# Altium project BrushlessDrive.PrjPcb
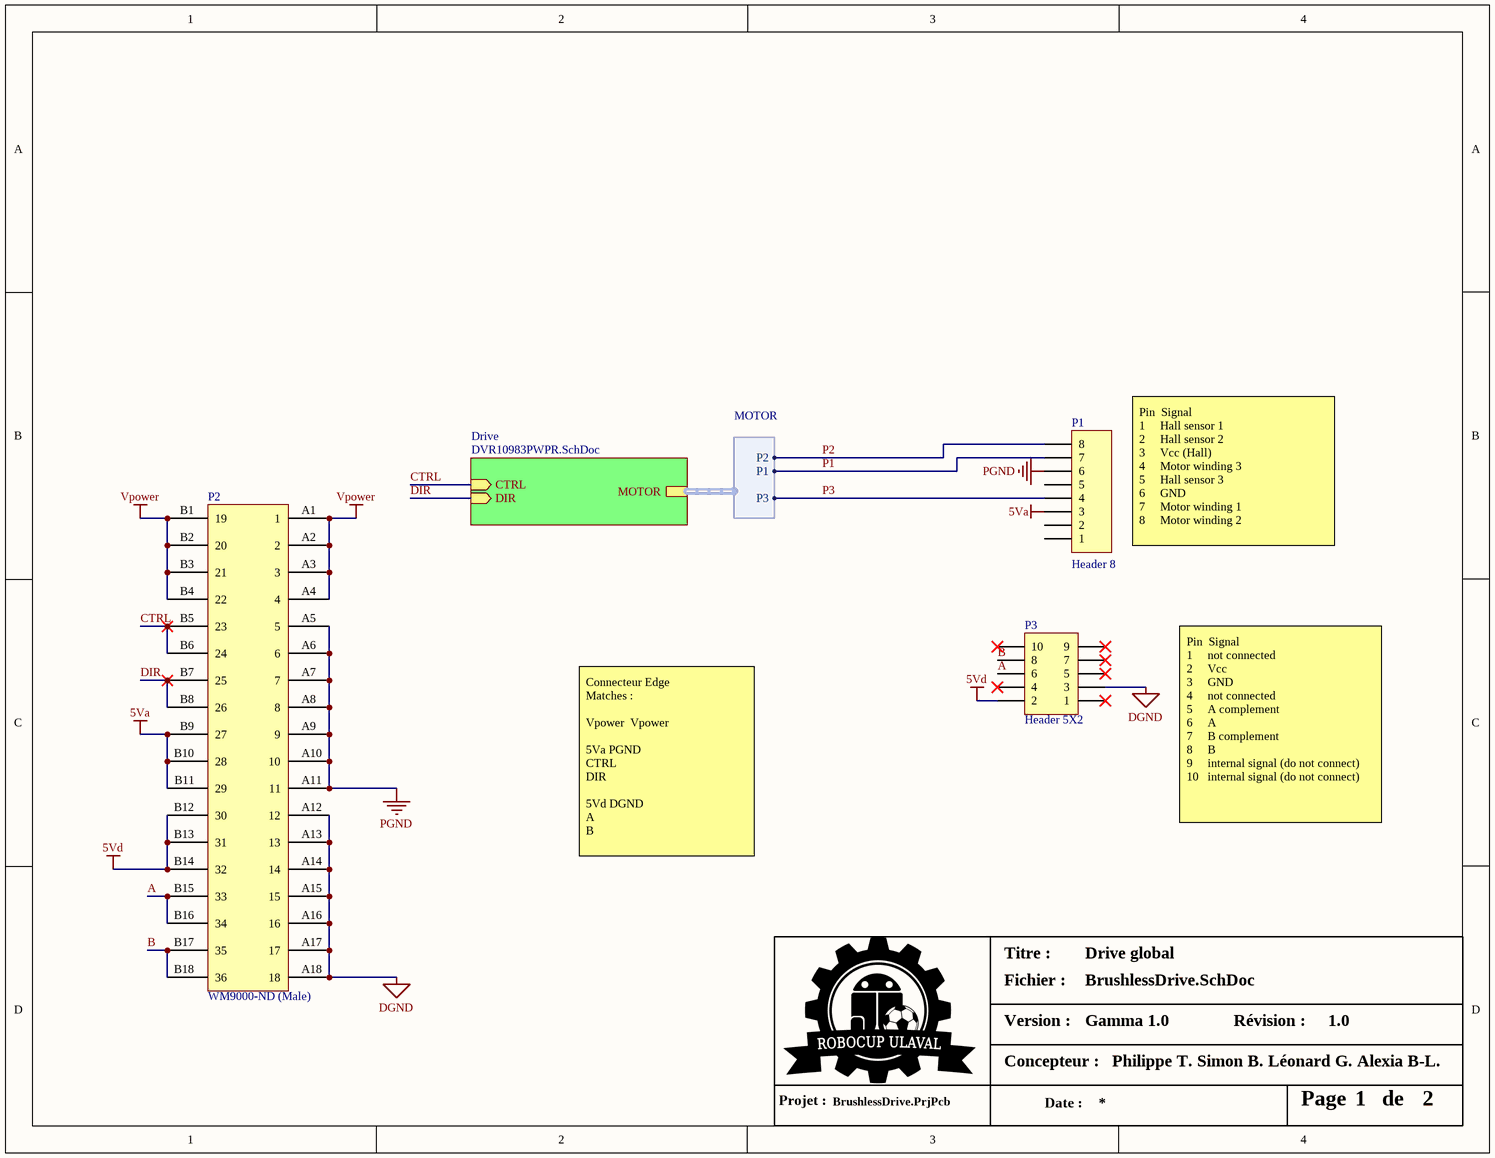
[diagram p0: BrushlessDrive.SchDoc]
2 sheets, 13 parts. Net scope: hierarchical (ports join the sheet entries above them; power ports are global).
Board file: PCB_BrushlessDrive.PcbDoc
Sheets:
  BrushlessDrive.SchDoc
    Drive = DVR10983PWPR.SchDoc

## Sheet BrushlessDrive.SchDoc: Drive global
size Letter; Organization: Robocup Ulaval; DocumentNumber: 1; Revision: 1.0; SheetNumber: 1; SheetTotal: 2; Conceptor: Philippe T. Simon B. Léonard G. Alexia B-L.; Version: Gamma 1.0

### Parts
P1  Header 8  [HallSensor Connector]
P2  WM9000-ND (Male)  [Edge connector 36Pos]
P3  Header 5X2  [Encoder Connector]

### Sub-sheets
Drive = DVR10983PWPR.SchDoc: MOTOR (harness MOTOR), CTRL (in), DIR (in)

### Harnesses
MOTOR: P1, P2, P3

### Nets
5Va: P1.3 P2.B9(27) P2.B10(28) P2.B11(29)
5Vd: P2.B12(30) P2.B13(31) P2.B14(32) P3.2
DGND: P2.A12(12) P2.A13(13) P2.A14(14) P2.A15(15) P2.A16(16) P2.A17(17) P2.A18(18) P3.3
PGND: P1.6 P2.A5(5) P2.A6(6) P2.A7(7) P2.A8(8) P2.A9(9) P2.A10(10) P2.A11(11)
Vpower: P2.A1(1) P2.A2(2) P2.A3(3) P2.A4(4) P2.B1(19) P2.B2(20) P2.B3(21) P2.B4(22)
A: P2.B15(33) P2.B16(34) P3.6
B: P2.B17(35) P2.B18(36) P3.8
CTRL: P2.B5(23) P2.B6(24) ; sheet Drive/CTRL
DIR: P2.B7(25) P2.B8(26) ; sheet Drive/DIR
P1: P1.7 ; sheet Drive/MOTOR.P1
P2: P1.8 ; sheet Drive/MOTOR.P2
P3: P1.4 ; sheet Drive/MOTOR.P3

Not connected (* = marked no-connect by the designer): P1 1 2 5; P3 1* 4* 5* 7* 9* 10*

### Notes on the sheet
- Pin  Signal
  1     Hall sensor 1
  2     Hall sensor 2
  3     Vcc (Hall)
  4     Motor winding 3
  5     Hall sensor 3
  6     GND
  7     Motor winding 1
  8     Motor winding 2
- Pin  Signal
  1     not connected
  2     Vcc
  3     GND
  4     not connected
  5     A complement
  6     A
  7     B complement
  8     B
  9     internal signal (do not connect)
  10   internal signal (do not connect)
- Connecteur Edge
  Matches :
  Vpower 	Vpower
  5Va	PGND
  CTRL
  DIR
  5Vd	DGND
  A
  B
- Titre :
- Version :
- Fichier :
- Révision :
- Projet :
- Concepteur :
- Date :
- Page
- de

### Library data of the parts
P1 = Header 8: Header, 8-Pin; LatestRevisionDate: 17-Jul-2002; LatestRevisionNote: Re-released for DXP Platform.; Publisher: Altium Limited
P3 = Header 5X2: Header, 5-Pin, Dual row; LatestRevisionDate: 17-Jul-2002; LatestRevisionNote: Re-released for DXP Platform.; Publisher: Altium Limited

## Sheet DVR10983PWPR.SchDoc
size A4
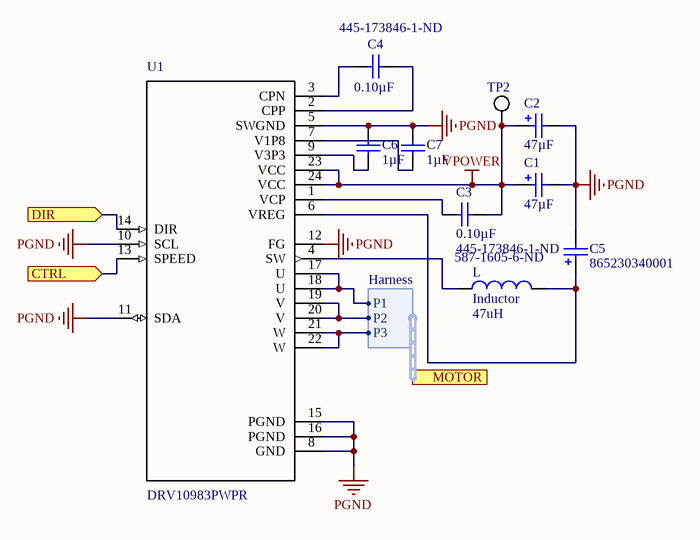
[diagram p1: DVR10983PWPR.SchDoc]

### Parts
C1  Capacitance: 47µF  [CAP 6.6x6.6mm]  (hidden comment: 865080645012)
C2  Capacitance: 47µF  [CAP 6.6x6.6mm]  (hidden comment: 865080645012)
C3  Capacitance: 0.10µF  Supplier Part Number 1: 445-173846-1-ND  [0603]  (hidden comment: CL10B104KB8SFNC)
C4  Capacitance: 0.10µF  Supplier Part Number 1: 445-173846-1-ND  [0603]  (hidden comment: CL10B104KB8SFNC)
C5  865230340001  [CAP 4.3x4.3mm]
C6  Capacitance: 1µF  [0805]  (hidden comment: CL21B105KBFNFNE)
C7  Capacitance: 1µF  [0805]  (hidden comment: CL21B105KBFNFNE)
L  Inductor  value 47uH  Supplier Part Number 1: 587-1605-6-ND  [*INDC2012X100N]
TP2  testpoint  [0805 testpoint]  (value not drawn)
U1  DRV10983PWPR  [*SOP65P640X120-25N]

### Ports
CTRL (in), DIR (in), MOTOR (harness Harness)

### Harnesses
Harness: P1, P2, P3

### Nets
PGND: C1.2 C2.2 C5.2 C6.2 C7.2 U1.5(SWGND) U1.8(GND) U1.10(SCL) U1.11(SDA) U1.12(FG) U1.15(PGND) U1.16(PGND)
Vpower: C1.1 C2.1 C3.2 TP2.1 U1.23(VCC) U1.24(VCC)
CTRL: U1.13(SPEED) ; port CTRL
DIR: U1.14(DIR) ; port DIR
P1: U1.17(U) U1.18(U) ; port MOTOR.P1
P2: U1.19(V) U1.20(V) ; port MOTOR.P2
P3: U1.21(W) U1.22(W) ; port MOTOR.P3
NetC3_1: C3.1 U1.1(VCP)
NetC4_1: C4.1 U1.3(CPN)
NetC4_2: C4.2 U1.2(CPP)
NetC5_1: C5.1 L.2 U1.6(VREG)
NetC6_1: C6.1 U1.9(V3P3)
NetC7_1: C7.1 U1.7(V1P8)
NetL_1: L.1 U1.4(SW)

### Library data of the parts
C1 C2 = 865080645012: CAP 47 UF 20% 50 V; Manufacturer: Wurth Electronics Inc; Voltage Rating: 50V; Lifetime @ Temp.: 2000 Hrs @ 105°C; Polarization: Polar; Ripple Current: 230mA @ 100kHz; Impedance: 700 mOhm; Surface Mount Land Size: 0.260" L x 0.260" W (6.60mm x 6.60mm); Supplier 1: Digi-Key; Manufacturer Part Number: 865080645012; RoHS: RoHS Compliant; Category: Capacitors; Stock 1: 803; Pricing 1: 1=0.48, 50=0.4072, 100=0.3547, 250=0.31528 (CAD); Packaging: Cut Tape (CT); Tolerance: ±20%; ESR (Equivalent Series Resistance): -; Operating Temperature: -55°C ~ 105°C; Applications: General Purpose; Lead Spacing: -; Size / Dimension: 0.248" Dia (6.30mm); Height - Seated (Max): 0.303" (7.70mm); Mounting Type: Surface Mount; Package / Case: Radial, Can - SMD; ComponentLink1URL: http://katalog.we-online.de/pbs/datasheet/865080645012.pdf; ComponentLink1Description: http://katalog.we-online.de/pbs/datasheet/865080645012.pdf; Supplier Part Number 1: 732-8457-1-ND
C3 C4 = CL10B104KB8SFNC: CAP CER 0.1UF 50V X7R 0603; Manufacturer: Samsung Electro-Mechanics America, Inc.; Tolerance: ±10%; Manufacturer Part Number: CL10B104KB8SFNC; RoHS: RoHS Compliant; Category: Capacitors; Packaging: Cut Tape (CT); Voltage - Rated: 50V; Temperature Coefficient: X7R; Mounting Type: Surface Mount, MLCC; Operating Temperature: -55°C ~ 125°C; Applications: Boardflex Sensitive; Ratings: -; Package / Case: 0603 (1608 Metric); Size / Dimension: 0.063" L x 0.031" W (1.60mm x 0.80mm); Height - Seated (Max): -; Thickness (Max): 0.035" (0.90mm); Lead Spacing: -; Features: Soft Termination; Lead Style: -; ComponentLink1URL: http://www.samsungsem.com/kr/support/product-search/mlcc/CL10B104KB8SFNC.jsp; ComponentLink1Description: http://www.samsungsem.com/kr/support/product-search/mlcc/CL10B104KB8SFNC.jsp; Supplier 1: Digi-Key
C5 = 865230340001: CAP 10 UF 20% 16 V; Manufacturer: Wurth Electronics Inc; Capacitance: 10µF; Voltage Rating: 16V; Lifetime @ Temp.: 5000 Hrs @ 105°C; Polarization: Polar; Ripple Current: 17mA @ 100kHz; Surface Mount Land Size: 0.169" L x 0.169" W (4.30mm x 4.30mm); Supplier 1: Digi-Key; Supplier Part Number 1: 732-8250-1-ND; Manufacturer Part Number: 865230340001; RoHS: RoHS Compliant; Category: Capacitors; Stock 1: 1549; Pricing 1: 1=0.27, 50=0.2274, 100=0.1981, 250=0.17608, 500=0.15406, 1000=0.14673 (CAD); Packaging: Cut Tape (CT); Tolerance: ±20%; ESR (Equivalent Series Resistance): -; Operating Temperature: -40°C ~ 105°C; Applications: General Purpose; Impedance: -; Lead Spacing: -; Size / Dimension: 0.157" Dia (4.00mm); Height - Seated (Max): 0.217" (5.50mm); Mounting Type: Surface Mount; Package / Case: Radial, Can - SMD; ComponentLink1URL: http://katalog.we-online.de/pbs/datasheet/865230340001.pdf; ComponentLink1Description: http://katalog.we-online.de/pbs/datasheet/865230340001.pdf
C6 C7 = CL21B105KBFNFNE: CAP CER 1UF 50V X7R 0805; Manufacturer: Samsung Electro-Mechanics America, Inc.; Tolerance: ±10%; Supplier 1: Digi-Key; Manufacturer Part Number: CL21B105KBFNFNE; RoHS: RoHS Compliant; Stock 1: 21699; Pricing 1: 1=0.27, 10=0.186, 25=0.14, 50=0.1072, 100=0.0884, 500=0.06238, 1000=0.05123 (CAD); Packaging: Cut Tape (CT); Voltage - Rated: 50V; Temperature Coefficient: X7R; Mounting Type: Surface Mount, MLCC; Operating Temperature: -55°C ~ 125°C; Applications: General Purpose; Ratings: -; Package / Case: 0805 (2012 Metric); Size / Dimension: 0.079" L x 0.049" W (2.00mm x 1.25mm); Height - Seated (Max): -; Thickness (Max): 0.053" (1.35mm); Lead Spacing: -; Features: -; Lead Style: -; ComponentLink1URL: http://www.samsungsem.com/kr/support/product-search/mlcc/CL21B105KBFNFNE.jsp; ComponentLink1Description: http://www.samsungsem.com/kr/support/product-search/mlcc/CL21B105KBFNFNE.jsp; Supplier Part Number 1: 1276-2928-1-ND; Category: Capacitors
L = Inductor: CBC2012T470M; Code_IEC: 1005; Published: 8-Jun-2000; LatestRevisionDate: 29-May-2009; LatestRevisionNote: IPC-7351 Footprint Added.; PackageReference: 0402-A; Publisher: Altium Limited; PackageDescription: Chip Inductor; Code_JEITA: 0402; ComponentLink1Description: CBC2012T470M; ComponentLink1URL: https://www.digikey.ca/product-detail/en/taiyo-yuden/CBC2012T470M/587-1605-2-ND/957985; Supplier 1: Digi-Key
U1 = DRV10983PWPR: Value: *

## Nets that join several sheets
PGND: BrushlessDrive (8 pins), DVR10983PWPR (12 pins)
Vpower: BrushlessDrive (8 pins), DVR10983PWPR (6 pins)
CTRL: BrushlessDrive (P2.B5 P2.B6), DVR10983PWPR (U1.13)
DIR: BrushlessDrive (P2.B7 P2.B8), DVR10983PWPR (U1.14)
P1: BrushlessDrive (P1.7), DVR10983PWPR (U1.17 U1.18)
P2: BrushlessDrive (P1.8), DVR10983PWPR (U1.19 U1.20)
P3: BrushlessDrive (P1.4), DVR10983PWPR (U1.21 U1.22)